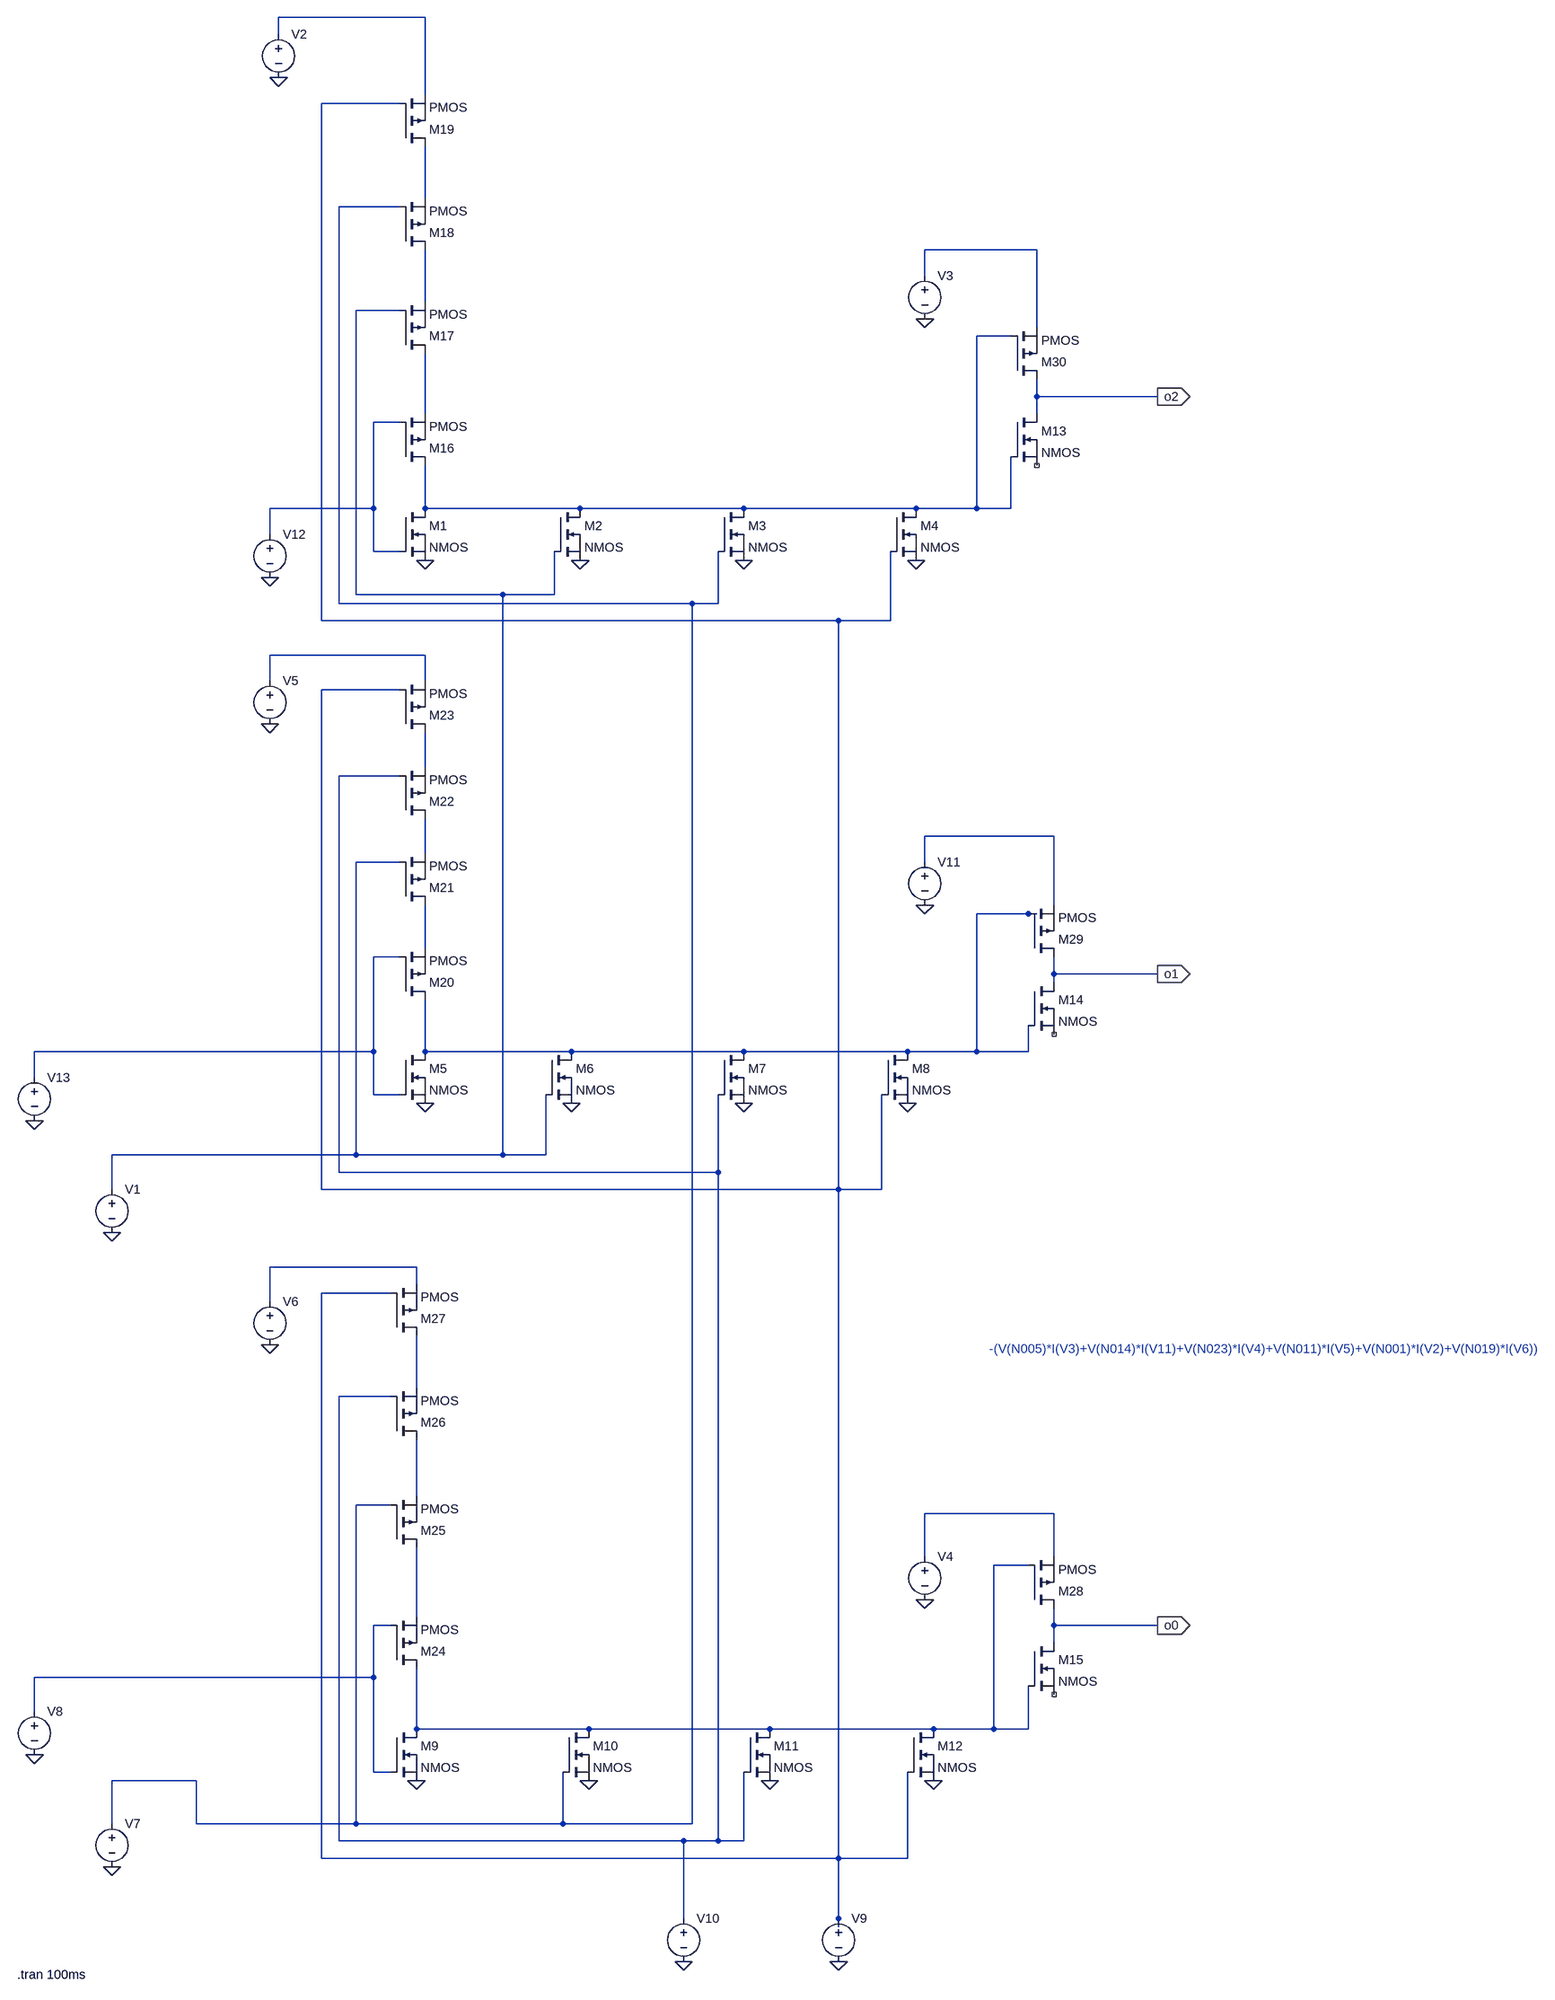
[diagram p0: schematic cmos.asc]
cmos.asc, the LTspice schematic file:
Version 4
SHEET 1 2808 3000
WIRE -1248 -656 -1520 -656
WIRE -1520 -624 -1520 -656
WIRE -1248 -512 -1248 -656
WIRE -1296 -496 -1440 -496
WIRE -1248 -320 -1248 -416
WIRE -1296 -304 -1408 -304
WIRE -112 -224 -320 -224
WIRE -320 -176 -320 -224
WIRE -1248 -128 -1248 -224
WIRE -1296 -112 -1376 -112
WIRE -112 -80 -112 -224
WIRE -160 -64 -224 -64
WIRE -112 48 -112 16
WIRE 112 48 -112 48
WIRE -1248 80 -1248 -32
WIRE -112 80 -112 48
WIRE -1296 96 -1344 96
WIRE -1344 256 -1344 96
WIRE -1344 256 -1536 256
WIRE -1248 256 -1248 176
WIRE -960 256 -1248 256
WIRE -656 256 -960 256
WIRE -336 256 -656 256
WIRE -224 256 -224 -64
WIRE -224 256 -336 256
WIRE -160 256 -160 160
WIRE -160 256 -224 256
WIRE -1536 304 -1536 256
WIRE -1344 336 -1344 256
WIRE -1296 336 -1344 336
WIRE -1376 416 -1376 -112
WIRE -1104 416 -1376 416
WIRE -1008 416 -1008 336
WIRE -1008 416 -1104 416
WIRE -1408 432 -1408 -304
WIRE -752 432 -1408 432
WIRE -704 432 -704 336
WIRE -704 432 -752 432
WIRE -1440 464 -1440 -496
WIRE -480 464 -1440 464
WIRE -384 464 -384 336
WIRE -384 464 -480 464
WIRE -1248 528 -1536 528
WIRE -1536 576 -1536 528
WIRE -1248 576 -1248 528
WIRE -1296 592 -1440 592
WIRE -1248 736 -1248 672
WIRE -1296 752 -1408 752
WIRE -80 864 -320 864
WIRE -1248 896 -1248 832
WIRE -1296 912 -1376 912
WIRE -320 912 -320 864
WIRE -80 992 -80 864
WIRE -128 1008 -224 1008
WIRE -112 1008 -128 1008
WIRE -1248 1072 -1248 992
WIRE -1296 1088 -1344 1088
WIRE -80 1120 -80 1088
WIRE 112 1120 -80 1120
WIRE -80 1136 -80 1120
WIRE -1344 1264 -1344 1088
WIRE -1344 1264 -2080 1264
WIRE -1248 1264 -1248 1168
WIRE -976 1264 -1248 1264
WIRE -656 1264 -976 1264
WIRE -352 1264 -656 1264
WIRE -224 1264 -224 1008
WIRE -224 1264 -352 1264
WIRE -128 1264 -128 1216
WIRE -128 1264 -224 1264
WIRE -2080 1312 -2080 1264
WIRE -1344 1344 -1344 1264
WIRE -1296 1344 -1344 1344
WIRE -1376 1456 -1376 912
WIRE -1376 1456 -1936 1456
WIRE -1104 1456 -1104 416
WIRE -1104 1456 -1376 1456
WIRE -1024 1456 -1024 1344
WIRE -1024 1456 -1104 1456
WIRE -1408 1488 -1408 752
WIRE -704 1488 -704 1344
WIRE -704 1488 -1408 1488
WIRE -1936 1520 -1936 1456
WIRE -1440 1520 -1440 592
WIRE -480 1520 -480 464
WIRE -480 1520 -1440 1520
WIRE -400 1520 -400 1344
WIRE -400 1520 -480 1520
WIRE -1264 1664 -1536 1664
WIRE -1264 1696 -1264 1664
WIRE -1312 1712 -1440 1712
WIRE -1536 1728 -1536 1664
WIRE -1264 1888 -1264 1792
WIRE -1312 1904 -1408 1904
WIRE -1264 2096 -1264 1984
WIRE -1312 2112 -1376 2112
WIRE -80 2128 -320 2128
WIRE -320 2208 -320 2128
WIRE -80 2208 -80 2128
WIRE -128 2224 -192 2224
WIRE -1264 2320 -1264 2192
WIRE -1312 2336 -1344 2336
WIRE -80 2336 -80 2304
WIRE 112 2336 -80 2336
WIRE -80 2368 -80 2336
WIRE -1344 2432 -1344 2336
WIRE -1344 2432 -2080 2432
WIRE -2080 2496 -2080 2432
WIRE -1264 2528 -1264 2416
WIRE -944 2528 -1264 2528
WIRE -608 2528 -944 2528
WIRE -304 2528 -608 2528
WIRE -192 2528 -192 2224
WIRE -192 2528 -304 2528
WIRE -128 2528 -128 2448
WIRE -128 2528 -192 2528
WIRE -1264 2544 -1264 2528
WIRE -1344 2608 -1344 2432
WIRE -1312 2608 -1344 2608
WIRE -1776 2624 -1936 2624
WIRE -1936 2704 -1936 2624
WIRE -1776 2704 -1776 2624
WIRE -1376 2704 -1376 2112
WIRE -1376 2704 -1776 2704
WIRE -992 2704 -992 2608
WIRE -992 2704 -1376 2704
WIRE -752 2704 -752 432
WIRE -752 2704 -992 2704
WIRE -1408 2736 -1408 1904
WIRE -768 2736 -1408 2736
WIRE -704 2736 -704 1488
WIRE -704 2736 -768 2736
WIRE -656 2736 -656 2608
WIRE -656 2736 -704 2736
WIRE -1440 2768 -1440 1712
WIRE -480 2768 -480 1520
WIRE -480 2768 -1440 2768
WIRE -352 2768 -352 2608
WIRE -352 2768 -480 2768
WIRE -768 2880 -768 2736
WIRE -480 2880 -480 2768
WIRE -480 2896 -480 2880
FLAG -2080 1392 0
FLAG -1936 1600 0
FLAG -1536 1808 0
FLAG -1248 1360 0
FLAG -976 1360 0
FLAG -656 1360 0
FLAG -320 992 0
FLAG -1536 384 0
FLAG -1248 352 0
FLAG -960 352 0
FLAG -656 352 0
FLAG -336 352 0
FLAG -320 -96 0
FLAG -1520 -544 0
FLAG -320 2288 0
FLAG -2080 2576 0
FLAG -1936 2784 0
FLAG -768 2960 0
FLAG -480 2960 0
FLAG -304 2624 0
FLAG -608 2624 0
FLAG -944 2624 0
FLAG -1264 2624 0
FLAG -352 1360 0
FLAG -1536 656 0
FLAG 112 48 o2
IOPIN 112 48 Out
FLAG 112 1120 o1
IOPIN 112 1120 Out
FLAG 112 2336 o0
IOPIN 112 2336 Out
SYMBOL nmos -1296 256 R0
SYMATTR InstName M1
SYMBOL nmos -1008 256 R0
SYMATTR InstName M2
SYMBOL nmos -704 256 R0
SYMATTR InstName M3
SYMBOL nmos -384 256 R0
SYMATTR InstName M4
SYMBOL nmos -1296 1264 R0
SYMATTR InstName M5
SYMBOL nmos -1024 1264 R0
SYMATTR InstName M6
SYMBOL nmos -704 1264 R0
SYMATTR InstName M7
SYMBOL nmos -400 1264 R0
SYMATTR InstName M8
SYMBOL nmos -1312 2528 R0
SYMATTR InstName M9
SYMBOL nmos -992 2528 R0
SYMATTR InstName M10
SYMBOL nmos -656 2528 R0
SYMATTR InstName M11
SYMBOL nmos -352 2528 R0
SYMATTR InstName M12
SYMBOL nmos -160 80 R0
SYMATTR InstName M13
SYMBOL nmos -128 1136 R0
SYMATTR InstName M14
SYMBOL nmos -128 2368 R0
SYMATTR InstName M15
SYMBOL pmos -1296 176 M180
SYMATTR InstName M16
SYMBOL pmos -1296 -32 M180
SYMATTR InstName M17
SYMBOL pmos -1296 -224 M180
SYMATTR InstName M18
SYMBOL pmos -1296 -416 M180
SYMATTR InstName M19
SYMBOL pmos -1296 1168 M180
SYMATTR InstName M20
SYMBOL pmos -1296 992 M180
SYMATTR InstName M21
SYMBOL pmos -1296 832 M180
SYMATTR InstName M22
SYMBOL pmos -1296 672 M180
SYMATTR InstName M23
SYMBOL pmos -1312 2416 M180
SYMATTR InstName M24
SYMBOL pmos -1312 2192 M180
SYMATTR InstName M25
SYMBOL pmos -1312 1984 M180
SYMATTR InstName M26
SYMBOL pmos -1312 1792 M180
SYMATTR InstName M27
SYMBOL pmos -128 2304 M180
SYMATTR InstName M28
SYMBOL pmos -128 1088 M180
SYMATTR InstName M29
SYMBOL pmos -160 16 M180
SYMATTR InstName M30
SYMBOL voltage -1936 1504 R0
WINDOW 3 24 96 Invisible 2
WINDOW 123 0 0 Left 0
WINDOW 39 0 0 Left 0
SYMATTR Value PULSE(0 1.8 24ms 0 0 10ms 100ms 1)
SYMATTR InstName V1
SYMBOL voltage -1520 -640 R0
WINDOW 3 24 96 Invisible 2
WINDOW 123 0 0 Left 0
WINDOW 39 0 0 Left 0
SYMATTR Value 1.8
SYMATTR InstName V2
SYMBOL voltage -320 -192 R0
WINDOW 3 24 96 Invisible 2
WINDOW 123 0 0 Left 0
WINDOW 39 0 0 Left 0
SYMATTR Value 1.8
SYMATTR InstName V3
SYMBOL voltage -320 2192 R0
WINDOW 3 24 96 Invisible 2
WINDOW 123 0 0 Left 0
WINDOW 39 0 0 Left 0
SYMATTR Value 1.8
SYMATTR InstName V4
SYMBOL voltage -1536 560 R0
WINDOW 3 24 96 Invisible 2
WINDOW 123 0 0 Left 0
WINDOW 39 0 0 Left 0
SYMATTR Value 1.8
SYMATTR InstName V5
SYMBOL voltage -1536 1712 R0
WINDOW 3 24 96 Invisible 2
WINDOW 123 0 0 Left 0
WINDOW 39 0 0 Left 0
SYMATTR Value 1.8
SYMATTR InstName V6
SYMBOL voltage -1936 2688 R0
WINDOW 3 24 96 Invisible 2
WINDOW 123 0 0 Left 0
WINDOW 39 0 0 Left 0
SYMATTR Value PULSE(0 1.8 48ms 0 0 10ms 100ms 1)
SYMATTR InstName V7
SYMBOL voltage -2080 2480 R0
WINDOW 3 24 96 Invisible 2
WINDOW 123 0 0 Left 0
WINDOW 39 0 0 Left 0
SYMATTR Value PULSE(0 1.8 36ms 0 0 10ms 100ms 1)
SYMATTR InstName V8
SYMBOL voltage -480 2864 R0
WINDOW 3 24 96 Invisible 2
WINDOW 123 0 0 Left 0
WINDOW 39 0 0 Left 0
SYMATTR Value PULSE(0 1.8 72ms 0 0 10ms 100ms 1)
SYMATTR InstName V9
SYMBOL voltage -768 2864 R0
WINDOW 3 24 96 Invisible 2
WINDOW 123 0 0 Left 0
WINDOW 39 0 0 Left 0
SYMATTR Value PULSE(0 1.8 60ms 0 0 10ms 100ms 1)
SYMATTR InstName V10
SYMBOL voltage -320 896 R0
WINDOW 3 24 96 Invisible 2
WINDOW 123 0 0 Left 0
WINDOW 39 0 0 Left 0
SYMATTR Value 1.8
SYMATTR InstName V11
SYMBOL voltage -1536 288 R0
WINDOW 3 24 96 Invisible 2
WINDOW 123 0 0 Left 0
WINDOW 39 0 0 Left 0
SYMATTR Value PULSE(0 1.8 0 0 0 10ms 100ms 1)
SYMATTR InstName V12
SYMBOL voltage -2080 1296 R0
WINDOW 3 24 96 Invisible 2
WINDOW 123 0 0 Left 0
WINDOW 39 0 0 Left 0
SYMATTR Value PULSE(0 1.8 12ms 0 0 10ms 100ms 1)
SYMATTR InstName V13
TEXT -2112 2984 Left 2 !.tran 100ms
TEXT -200 1816 Left 2 ;-(V(N005)*I(V3)+V(N014)*I(V11)+V(N023)*I(V4)+V(N011)*I(V5)+V(N001)*I(V2)+V(N019)*I(V6))

The netlist it stands for:
* cmos.asc
M1 N008 N010 0 0 NMOS
M2 N008 N007 0 0 NMOS
M3 N008 N004 0 0 NMOS
M4 N008 N002 0 0 NMOS
M5 N016 N018 0 0 NMOS
M6 N016 N007 0 0 NMOS
M7 N016 N013 0 0 NMOS
M8 N016 N002 0 0 NMOS
M9 N023 N025 0 0 NMOS
M10 N023 N004 0 0 NMOS
M11 N023 N013 0 0 NMOS
M12 N023 N002 0 0 NMOS
M13 o2 N008 NC_01 NC_01 NMOS
M14 o1 N016 NC_02 NC_02 NMOS
M15 o0 N023 NC_03 NC_03 NMOS
M16 N008 N010 N009 N009 PMOS
M17 N009 N007 N006 N006 PMOS
M18 N006 N004 N003 N003 PMOS
M19 N003 N002 N001 N001 PMOS
M20 N016 N018 N017 N017 PMOS
M21 N017 N007 N015 N015 PMOS
M22 N015 N013 N012 N012 PMOS
M23 N012 N002 N011 N011 PMOS
M24 N023 N025 N024 N024 PMOS
M25 N024 N004 N021 N021 PMOS
M26 N021 N013 N020 N020 PMOS
M27 N020 N002 N019 N019 PMOS
M28 o0 N023 N022 N022 PMOS
M29 o1 N016 N014 N014 PMOS
M30 o2 N008 N005 N005 PMOS
V1 N007 0 PULSE(0 1.8 24ms 0 0 10ms 100ms 1)
V2 N001 0 1.8
V3 N005 0 1.8
V4 N022 0 1.8
V5 N011 0 1.8
V6 N019 0 1.8
V7 N004 0 PULSE(0 1.8 48ms 0 0 10ms 100ms 1)
V8 N025 0 PULSE(0 1.8 36ms 0 0 10ms 100ms 1)
V9 N002 0 PULSE(0 1.8 72ms 0 0 10ms 100ms 1)
V10 N013 0 PULSE(0 1.8 60ms 0 0 10ms 100ms 1)
V11 N014 0 1.8
V12 N010 0 PULSE(0 1.8 0 0 0 10ms 100ms 1)
V13 N018 0 PULSE(0 1.8 12ms 0 0 10ms 100ms 1)
.model NMOS NMOS
.model PMOS PMOS
.lib standard.mos
.tran 100ms
* -(V(N005)*I(V3)+V(N014)*I(V11)+V(N023)*I(V4)+V(N011)*I(V5)+V(N001)*I(V2)+V(N019)*I(V6))
.backanno
.end